# EAGLE design ControlV2 (EAGLE 9.1.0)
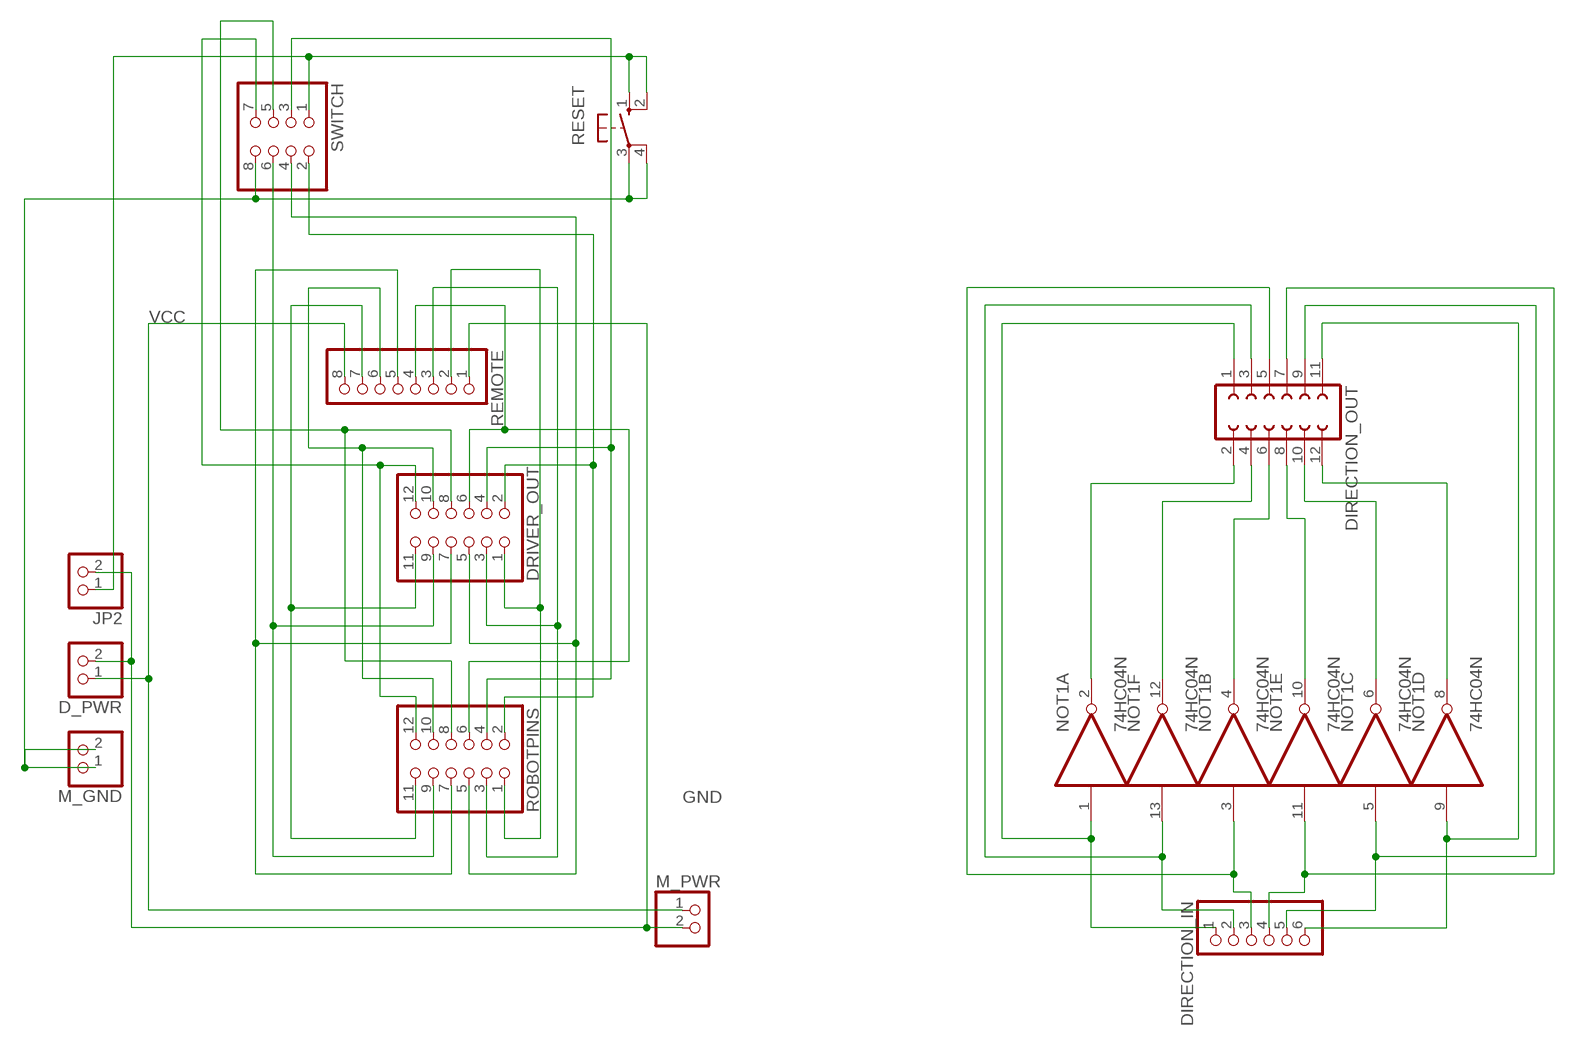
[diagram p0: schematic, sheet 1]

## Parts
D_PWR  PINHD-1X2  [1X02]
DIRECTION_IN  PINHD-1X6  [1X06]
DIRECTION_OUT  FE06-2  [FE06-2]
DRIVER_OUT  PINHD-2X6  [2X06]
JP2  PINHD-1X2  [1X02]
M_GND  PINHD-1X2  [1X02]
M_PWR  PINHD-1X2  [1X02]
NOT1  74HC04N  [DIL14]
REMOTE  PINHD-1X8  [1X08]
RESET  10-XX  [B3F-10XX]
ROBOTPINS  PINHD-2X6  [2X06]
SWITCH  PINHD-2X4  [2X04]

## Nets
GND: D_PWR.2 JP2.2 M_PWR.2 REMOTE.1
N$1: M_GND.1 M_GND.2 RESET.3(P) RESET.4(P1) SWITCH.8
N$2: JP2.1 RESET.1(S) RESET.2(S1) SWITCH.1
N$4: DRIVER_OUT.2 ROBOTPINS.2 SWITCH.2
N$6: DRIVER_OUT.4 ROBOTPINS.4 SWITCH.3
N$7: DRIVER_OUT.6 REMOTE.4 ROBOTPINS.6
N$8: DRIVER_OUT.12 ROBOTPINS.12 SWITCH.7
N$9: DRIVER_OUT.10 REMOTE.6 ROBOTPINS.10
N$10: DRIVER_OUT.8 ROBOTPINS.8 SWITCH.5
N$11: DRIVER_OUT.11 REMOTE.7 ROBOTPINS.11
N$12: DRIVER_OUT.9 ROBOTPINS.9 SWITCH.6
N$13: DRIVER_OUT.7 REMOTE.5 ROBOTPINS.7
N$14: DRIVER_OUT.5 ROBOTPINS.5 SWITCH.4
N$15: DRIVER_OUT.3 REMOTE.3 ROBOTPINS.3
N$16: DRIVER_OUT.1 REMOTE.2 ROBOTPINS.1
N$17: DIRECTION_IN.1 DIRECTION_OUT.1 NOT1.1(A:I)
N$18: DIRECTION_IN.2 DIRECTION_OUT.3 NOT1.13(F:I)
N$19: DIRECTION_IN.3 DIRECTION_OUT.5 NOT1.3(B:I)
N$22: DIRECTION_IN.4 DIRECTION_OUT.7 NOT1.11(E:I)
N$23: DIRECTION_IN.5 DIRECTION_OUT.9 NOT1.5(C:I)
N$24: DIRECTION_IN.6 DIRECTION_OUT.11 NOT1.9(D:I)
N$26: DIRECTION_OUT.2 NOT1.2(A:O)
N$27: DIRECTION_OUT.12 NOT1.8(D:O)
N$28: DIRECTION_OUT.4 NOT1.12(F:O)
N$29: DIRECTION_OUT.6 NOT1.4(B:O)
N$30: DIRECTION_OUT.8 NOT1.10(E:O)
N$31: DIRECTION_OUT.10 NOT1.6(C:O)
VCC: D_PWR.1 M_PWR.1 REMOTE.8

## Power pins joined to a net without a drawn wire
GND: NOT1.7(P:GND)
VCC: NOT1.14(P:VCC)

## Library data of the parts
D_PWR JP2 M_GND M_PWR = pinhead:PINHD-1X2: PIN HEADER
DIRECTION_IN = pinhead:PINHD-1X6: PIN HEADER
DIRECTION_OUT = con-lsta:FE06-2: FEMALE HEADER; OC_FARNELL: unknown; OC_NEWARK: unknown
DRIVER_OUT ROBOTPINS = pinhead:PINHD-2X6: PIN HEADER
NOT1 = 74xx-eu:74*04: Hex INVERTER; SPICEPREFIX: B
REMOTE = pinhead:PINHD-1X8: PIN HEADER
RESET = switch-omron:10-XX: OMRON SWITCH; MPN: B3F-1000; OC_FARNELL: 176432; OC_NEWARK: 36M3542
SWITCH = pinhead:PINHD-2X4: PIN HEADER; SPICEPREFIX: X

## Board
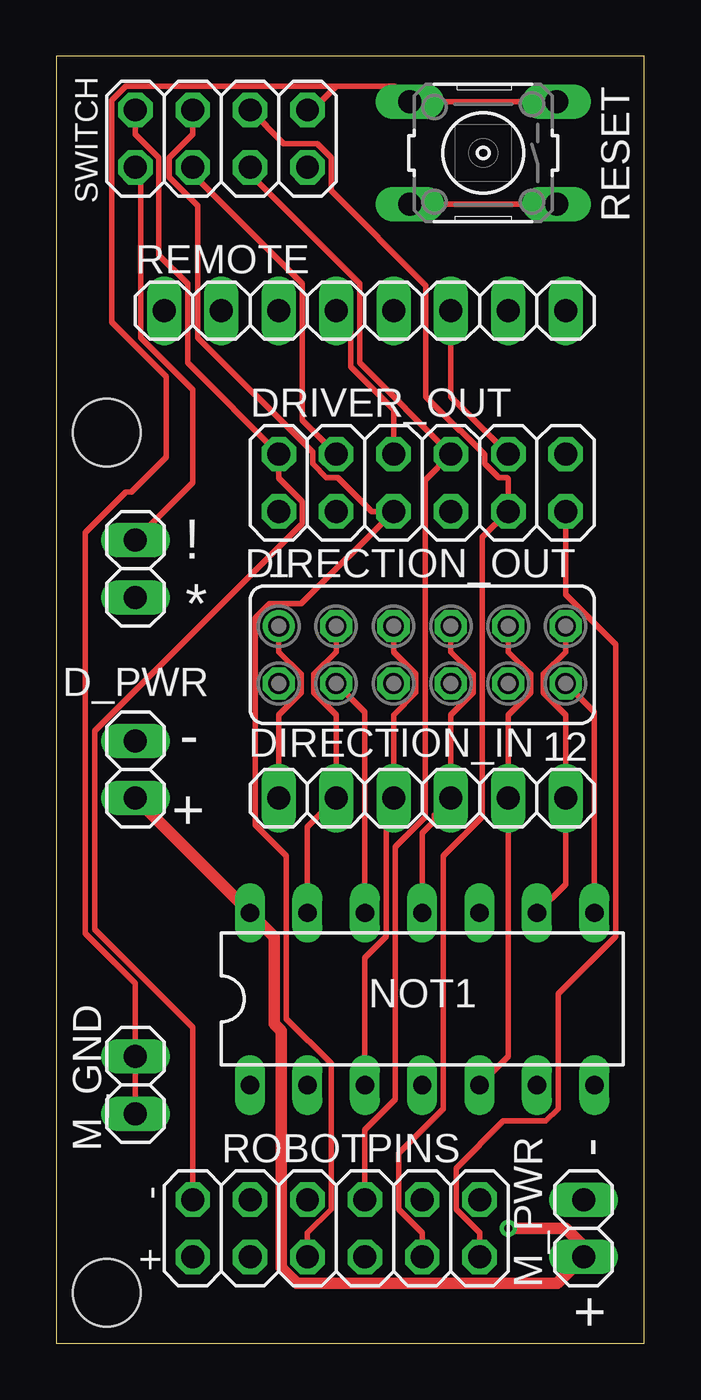
[diagram p1: board, top side]
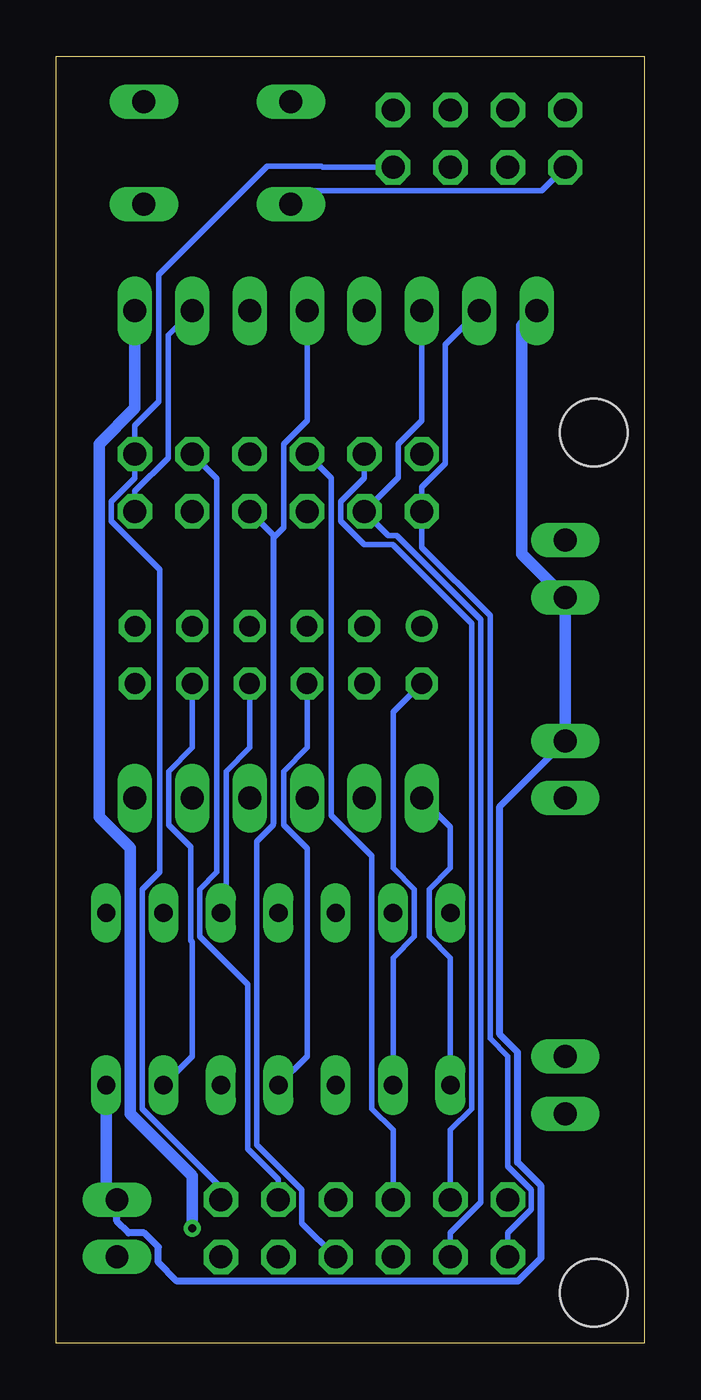
[diagram p2: board, bottom side, seen from below]

Size 26.02 x 56.98 mm. Coordinates in mm from the lower left corner, seen from the top.
Outline: 0,0 26.02,0 26.02,56.98 0,56.98 0,0
Copper layers (1*16): Top 0.035mm / dielectric 1.5mm / Bottom 0.035mm
Design rules "default": minimum track width 6mil, minimum drill 0.35mm, track to track 6mil, track to pad 6mil, pad to pad 6mil, via to via 6mil, smd to smd 6mil, copper to edge 40mil, drill to drill 6mil, minimum pad ring 10mil, minimum via ring 8mil, stop-mask expansion 4mil, vias tented up to drill 0mil, thermal gap 10mil
Holes 3 mm at 2.22,2.22 2.22,40.32

### Footprints (pad centres in the part's own frame; a part is rotated, then mirrored left to right if it is on the bottom)
1X02 = drill 1.016 long: 1 -1.27,0; 2 1.27,0
1X06 = drill 1.016 long: 1 -6.35,0; 2 -3.81,0; 3 -1.27,0; 4 1.27,0; 5 3.81,0; 6 6.35,0
FE06-2 = drill 0.914: 1 -6.35,1.27 | drill 0.914 octagon: 2 -6.35,-1.27; 3 -3.81,1.27; 4 -3.81,-1.27; 5 -1.27,1.27; 6 -1.27,-1.27; 7 1.27,1.27; 8 1.27,-1.27; 9 3.81,1.27; 10 3.81,-1.27; 11 6.35,1.27; 12 6.35,-1.27
2X06 = drill 1.016 octagon: 1 -6.35,-1.27; 2 -6.35,1.27; 3 -3.81,-1.27; 4 -3.81,1.27; 5 -1.27,-1.27; 6 -1.27,1.27; 7 1.27,-1.27; 8 1.27,1.27; 9 3.81,-1.27; 10 3.81,1.27; 11 6.35,-1.27; 12 6.35,1.27
DIL14 = drill 0.813 long: 1 -7.62,-3.81; 2 -5.08,-3.81; 3 -2.54,-3.81; 4 0,-3.81; 5 2.54,-3.81; 6 5.08,-3.81; 7 7.62,-3.81; 8 7.62,3.81; 9 5.08,3.81; 10 2.54,3.81; 11 0,3.81; 12 -2.54,3.81; 13 -5.08,3.81; 14 -7.62,3.81
1X08 = drill 1.016 long: 1 -8.89,0; 2 -6.35,0; 3 -3.81,0; 4 -1.27,0; 5 1.27,0; 6 3.81,0; 7 6.35,0; 8 8.89,0
B3F-10XX = drill 1.016 long: 1 -3.251,2.261; 2 3.251,2.261; 3 -3.251,-2.261; 4 3.251,-2.261
2X04 = drill 1.016 octagon: 1 -3.81,-1.27; 2 -3.81,1.27; 3 -1.27,-1.27; 4 -1.27,1.27; 5 1.27,-1.27; 6 1.27,1.27; 7 3.81,-1.27; 8 3.81,1.27

### Placement (x,y rotation side)
D_PWR  3.49,25.4 90 top
DIRECTION_IN  16.19,24.13 0 top
DIRECTION_OUT  16.19,30.48 0 top
DRIVER_OUT  16.19,38.1 0 top
JP2  3.49,34.29 270 top
M_GND  3.49,11.43 90 top
M_PWR  23.34,5.08 90 top
NOT1  16.19,15.24 0 top
REMOTE  13.65,45.72 0 top
RESET  18.89,52.7 180 top
ROBOTPINS  12.38,5.08 0 top
SWITCH  7.3,53.34 0 top

### Tracks (layer width: path | path; a pad name or v marks a point on that pad's centre or on a via)
GND
  Bottom 0.305: D_PWR.2 6.39,23.77 6.39,13.67 5.6,12.88 5.6,8 4.56,6.96 4.56,3.77 5.59,2.74 20.68,2.74 21.51,3.57 21.51,4.25 22.13,4.88 22.82,4.88 23.34,5.4 M_PWR.2
  Bottom 0.508: D_PWR.2 JP2.2 5.42,34.95 5.42,45.06 REMOTE.1 | M_PWR.2 23.81,6.83 NOT1.7
N$1
  Top 0.254: M_GND.1 M_GND.2 3.49,15.94 1.28,18.14 1.28,35.89 3.07,37.68 3.32,37.68 4.86,39.23 4.86,42.81 2.45,45.22 2.45,55.04 3.06,55.65 12.38,55.65 | 12.38,55.65 14.95,55.65 RESET.4 RESET.3 | SWITCH.8 11.34,54.61 12.38,55.65
N$2
  Top 0.254: RESET.2 RESET.1 | JP2.1 6.03,38.1 6.03,42.22 3.72,44.53 3.72,51.84 SWITCH.1
  Bottom 0.254: SWITCH.1 4.53,51.03 15.06,51.03 RESET.2
N$4
  Top 0.254: ROBOTPINS.2 6.03,13.97 1.69,18.31 1.69,27.1 10.88,36.3 10.88,37.26 9.84,38.3 DRIVER_OUT.2 5.8,43.41 5.8,46.91 4.53,48.18 4.53,52.5 3.49,53.54 SWITCH.2
N$6
  Top 0.254: DRIVER_OUT.4 10.88,40.87 10.88,46.91 6.03,51.77 SWITCH.3
  Bottom 0.254: ROBOTPINS.4 8.57,9.44 7.63,10.38 7.63,31.87 11.12,35.36 12.39,35.36 13.42,36.4 13.42,37.26 12.38,38.3 DRIVER_OUT.4
N$7
  Top 0.254: REMOTE.4 13.02,45.09 13.02,43.24 14.92,41.34 DRIVER_OUT.6
  Bottom 0.254: DRIVER_OUT.6 13.85,38.3 13.85,23.36 12.05,21.57 12.05,10.38 11.11,9.44 ROBOTPINS.6
N$8
  Bottom 0.254: ROBOTPINS.12 18.73,6.9 22.21,10.38 22.21,20.1 21.45,20.86 21.45,34.27 23.58,36.4 23.58,37.26 22.54,38.3 DRIVER_OUT.12 22.54,40.64 21.48,41.7 21.48,47.31 16.68,52.12 14.29,52.12 14.24,52.07 SWITCH.7
N$9
  Top 0.254: DRIVER_OUT.10 17.46,41.91 REMOTE.6
  Bottom 0.254: ROBOTPINS.10 16.19,7.25 17.55,8.61 17.55,15.88 19.67,18 19.67,20.1 18.91,20.86 18.91,38.28 DRIVER_OUT.10
N$10
  Top 0.254: SWITCH.5 8.57,51.77 13.42,46.91 13.42,43.41 DRIVER_OUT.8 16.32,38.23 16.32,23.29 15,21.97 15,10.79 13.65,9.44 ROBOTPINS.8
N$11
  Top 0.254: ROBOTPINS.11 18.73,4.88 17.69,5.92 17.69,7.74 19.78,9.83 21.66,9.83 22.21,10.38 22.21,15.46 24.75,18 24.75,30.94 22.54,33.15 DRIVER_OUT.11
  Bottom 0.254: DRIVER_OUT.11 22.54,37.73 21.08,39.2 21.08,44.65 REMOTE.7
N$12
  Top 0.254: ROBOTPINS.9 16.19,4.88 15.15,5.92 15.15,8.4 17.13,10.38 17.13,21.57 18.86,23.29 18.86,35.69 DRIVER_OUT.9 20,38.26 19.93,38.33 19.57,38.33 18.96,38.94 18.96,39.34 17.89,40.41 17.85,40.41 16.35,41.91 16.35,46.83 12.15,51.03 12.15,52.5 11.54,53.11 10.07,53.11 SWITCH.6
N$13
  Bottom 0.152: 17.14,21.59 17.14,22.23 16.35,23.02 16.35,35.72 DRIVER_OUT.7
  Bottom 0.254: ROBOTPINS.7 15.15,5.31 15.15,6.78 17.14,8.78 17.14,21.59 17.14,22.21 16.42,22.94 16.42,35.79 DRIVER_OUT.7 | REMOTE.5 14.92,40.84 15.96,39.8 15.96,36.11 16.35,35.72
N$14
  Top 0.254: ROBOTPINS.5 11.11,4.88 12.15,5.92 12.15,12.38 10.17,14.36 10.17,21.57 8.8,22.94 8.8,32.11 9.43,32.74 10.83,32.74 DRIVER_OUT.5 13.96,36.83 12.46,38.33 11.95,38.33 11.34,38.94 11.34,39.45 6.26,44.53 6.26,50.37 4.99,51.64 4.99,52.5 6.03,53.54 SWITCH.4
N$15
  Bottom 0.254: REMOTE.3 9.84,40.84 10.88,39.8 10.88,38.33 DRIVER_OUT.3 11.32,35.77 10.96,35.77 7.23,32.04 7.23,6.22 8.57,4.88 ROBOTPINS.3
N$16
  Bottom 0.254: ROBOTPINS.1 6.03,4.88 4.99,5.92 4.99,6.78 6.03,7.82 6.03,12.7 6.82,13.49 6.82,32.21 9.84,35.23 DRIVER_OUT.1 9.84,37.9 8.8,38.94 8.8,44.22 REMOTE.2
N$17
  Top 0.254: DIRECTION_OUT.1 9.84,30.61 10.83,29.62 10.83,28.8 9.84,27.81 DIRECTION_IN.1
  Bottom 0.254: DIRECTION_IN.1 8.57,22.86 8.57,21.04 9.51,20.1 9.51,18 8.57,17.06 NOT1.1
N$18
  Top 0.254: NOT1.13 11.11,22.86 DIRECTION_IN.2 12.38,27.81 11.39,28.8 11.39,29.62 12.38,30.61 DIRECTION_OUT.3
N$19
  Top 0.254: DIRECTION_OUT.5 14.92,30.61 15.91,29.62 15.91,28.8 14.92,27.81 DIRECTION_IN.3 14.59,23.8 14.59,18 13.65,17.06 NOT1.3
N$22
  Top 0.254: DIRECTION_OUT.7 17.46,30.61 18.45,29.62 18.45,28.8 17.46,27.81 DIRECTION_IN.4 16.73,23.39 16.73,23.12 16.19,22.59 NOT1.11
N$23
  Top 0.254: DIRECTION_OUT.9 20,30.61 20.99,29.62 20.99,28.8 20,27.81 DIRECTION_IN.5 20,12.7 NOT1.5
N$24
  Top 0.254: NOT1.9 22.54,20.32 DIRECTION_IN.6 22.54,27.81 21.55,28.8 21.55,29.62 22.54,30.61 DIRECTION_OUT.11
N$26
  Bottom 0.254: DIRECTION_OUT.2 11.11,27.94 11.11,21.04 10.17,20.1 10.17,18 11.11,17.06 NOT1.2
N$27
  Top 0.254: NOT1.8 23.81,27.94 DIRECTION_OUT.12
N$28
  Top 0.254: NOT1.12 13.65,27.94 DIRECTION_OUT.4
N$29
  Bottom 0.254: NOT1.4 14.92,12.7 14.92,21.89 15.96,22.94 15.96,25.32 14.92,26.36 DIRECTION_OUT.6
N$30
  Bottom 0.254: DIRECTION_OUT.8 17.46,26.36 18.5,25.32 18.5,19.28 NOT1.10
N$31
  Bottom 0.254: NOT1.6 20,12.7 20,17.76 20.08,17.83 20.08,21.97 21.04,22.94 21.04,25.32 20,26.36 DIRECTION_OUT.10
VCC  (via drill 0.35)
  Top 0.508: M_PWR.1 23.34,4.25 | D_PWR.1 NOT1.14 9.64,17.98 9.64,14.14 9.94,13.83 9.94,3.33 10.63,2.64 22.17,2.64 M_PWR.1 | M_PWR.1 23.34,4.29 22.54,5.08 v20,5.08
  Bottom 0.508: v20,5.08 20,7.42 22.75,10.16 22.75,21.92 24.12,23.29 24.12,39.82 22.54,41.39 REMOTE.8

### Text on the board
tPlace: - | +
tNames: ! | * | - | + | - | +